# Altium schematic sheet LCL_prec_5V.SchDoc
size A3; Organization: Altium Limited; Address1: L3, 12a Rodborough Rd; Address2: Frenchs Forest; Address3: NSW; Address4: Australia 2086
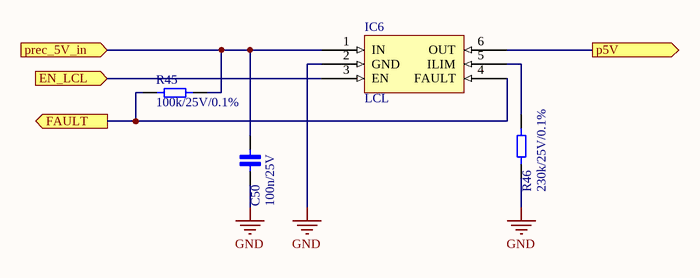
[diagram p0: LCL_prec_5V.SchDoc]

## Parts
C50  100n/25V  [CAP_0603]
IC6  LCL  [SOT-23-6]
R45  100k/25V/0.1%  [RES_0603]
R46  230k/25V/0.1%  [RES_0603]

## Ports
EN_LCL (in), FAULT (out), p5V (out), prec_5V_in (in)

## Nets
GND: C50.2 IC6.2(GND) R46.2
EN_LCL: IC6.3(EN) ; port EN_LCL
FAULT: IC6.4(FAULT) R45.2 ; port FAULT
p5V: IC6.6(OUT) ; port p5V
prec_5V_in: C50.2 IC6.1(IN) R45.2 ; port prec_5V_in
NetIC6_5: IC6.5(ILIM) R46.2

## Notes on the sheet
- Title
- Size:
- Date:
- A3
- Number:
- Time:
- Revision:
- Sheet
- of
- File:

## Library data of the parts
C50 = Cap_0603_100n: Ceramic Capacitor 100n / 0603 / 25V / ±5%, Wurth Elektronik MLCC; ComponentLink1Description: New link; ComponentLink1URL: https://www.we-online.com/catalog/en/WCAP-CSGP-25VDC
IC6 = TPS2553: Latch-off Current Limiter; ComponentLink1Description: New link; ComponentLink1URL: https://www.ti.com/lit/ds/symlink/tps2553.pdf?ts=1603819295065&ref_url=https%253A%252F%252Fwww.google.com%252F
R45 = Res_0603_100k: Vishay, thin film resistor 100k/25V/0.1%
R46 = Res_0603_230k: Vishay, thin film resistor 230k/25V/0.1%